# Altium schematic sheet MBD-SM.SchDoc
size A3; SheetNumber: 1; SheetTotal: 1
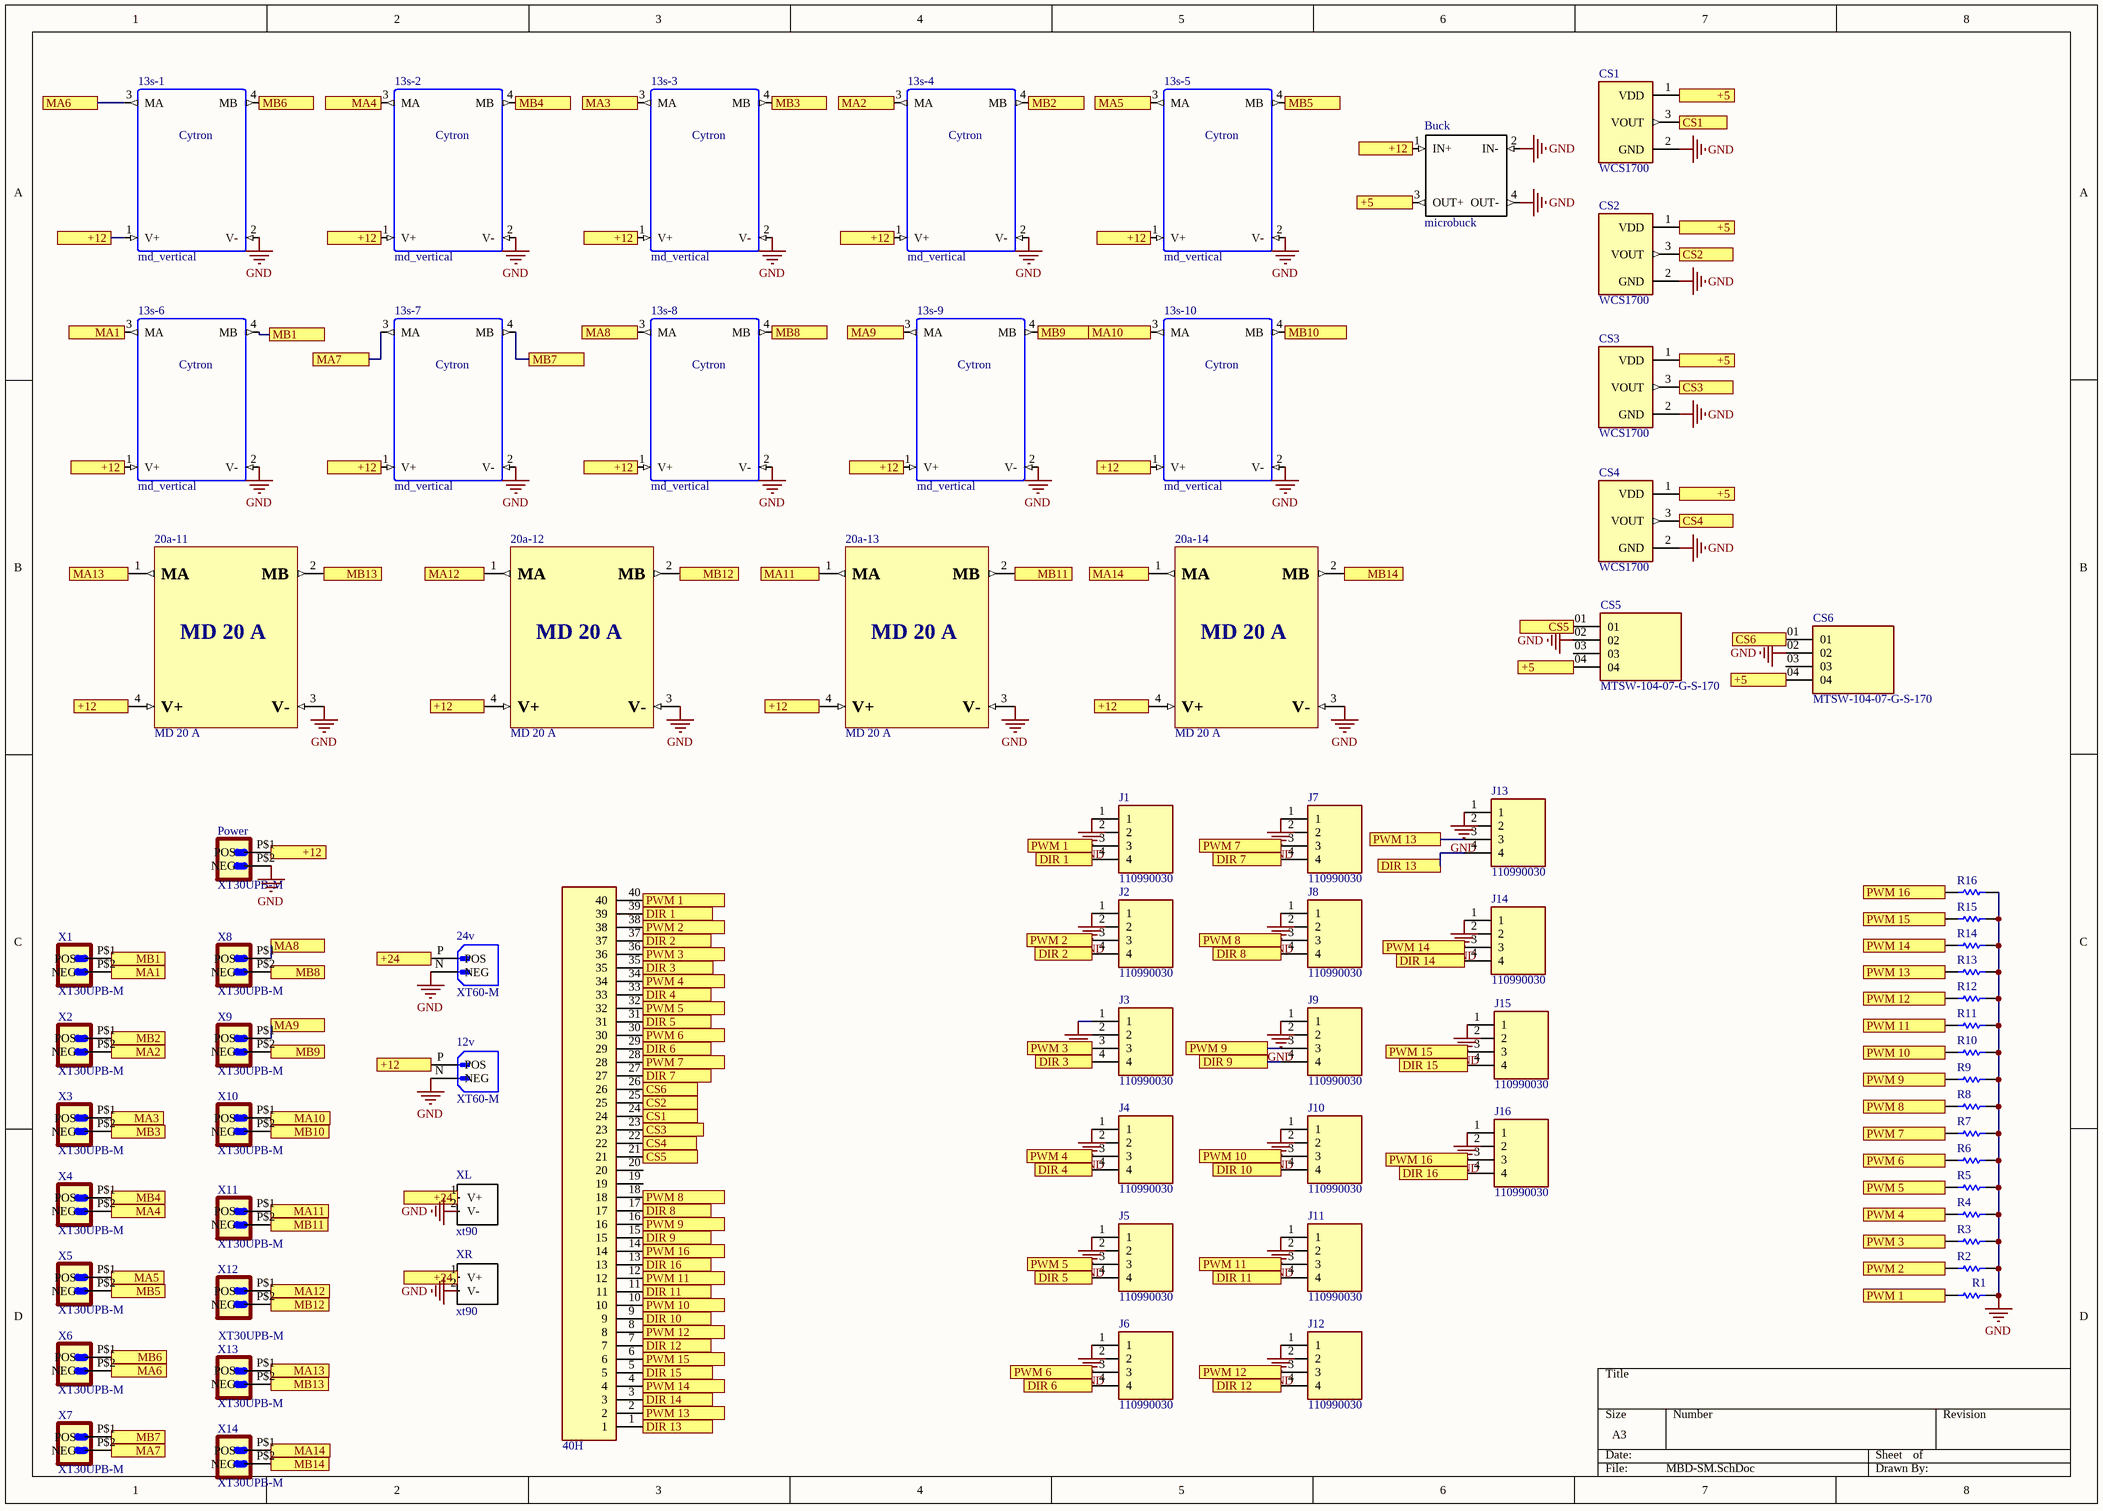
[diagram p0: MBD-SM.SchDoc]

## Parts
12v  XT60-M  [AMASS_XT60-M]
13s-1  md_vertical  [md_vertical]
13s-2  md_vertical  [md_vertical]
13s-3  md_vertical  [md_vertical]
13s-4  md_vertical  [md_vertical]
13s-5  md_vertical  [md_vertical]
13s-6  md_vertical  [md_vertical]
13s-7  md_vertical  [md_vertical]
13s-8  md_vertical  [md_vertical]
13s-9  md_vertical  [md_vertical]
13s-10  md_vertical  [md_vertical]
20a-11  MD 20 A  [MD20A]
20a-12  MD 20 A  [MD20A]
20a-13  MD 20 A  [MD20A]
20a-14  MD 20 A  [MD20A]
24v  XT60-M  [AMASS_XT60-M]
40H  3-1761603-3  [TE_3-1761603-3]  (value not drawn)
Buck  microbuck  [Micro buck]
CS1  WCS1700  [XDCR_WCS1700]
CS2  WCS1700  [XDCR_WCS1700]
CS3  WCS1700  [XDCR_WCS1700]
CS4  WCS1700  [XDCR_WCS1700]
CS5  MTSW-104-07-G-S-170  [SAMTEC_MTSW-104-07-G-S-170]
CS6  MTSW-104-07-G-S-170  [SAMTEC_MTSW-104-07-G-S-170]
J1  110990030  [SEEED_110990030]
J2  110990030  [SEEED_110990030]
J3  110990030  [SEEED_110990030]
J4  110990030  [SEEED_110990030]
J5  110990030  [SEEED_110990030]
J6  110990030  [SEEED_110990030]
J7  110990030  [SEEED_110990030]
J8  110990030  [SEEED_110990030]
J9  110990030  [SEEED_110990030]
J10  110990030  [SEEED_110990030]
J11  110990030  [SEEED_110990030]
J12  110990030  [SEEED_110990030]
J13  110990030  [SEEED_110990030]
J14  110990030  [SEEED_110990030]
J15  110990030  [SEEED_110990030]
J16  110990030  [SEEED_110990030]
Power  XT30UPB-M  [XT30UPB-M]
R1  CRCW060310K0FKEA  [RESC1609X50X30NL8T20]  (value not drawn)
R2  CRCW060310K0FKEA  [RESC1609X50X30NL8T20]  (value not drawn)
R3  CRCW060310K0FKEA  [RESC1609X50X30NL8T20]  (value not drawn)
R4  CRCW060310K0FKEA  [RESC1609X50X30NL8T20]  (value not drawn)
R5  CRCW060310K0FKEA  [RESC1609X50X30NL8T20]  (value not drawn)
R6  CRCW060310K0FKEA  [RESC1609X50X30NL8T20]  (value not drawn)
R7  CRCW060310K0FKEA  [RESC1609X50X30NL8T20]  (value not drawn)
R8  CRCW060310K0FKEA  [RESC1609X50X30NL8T20]  (value not drawn)
R9  CRCW060310K0FKEA  [RESC1609X50X30NL8T20]  (value not drawn)
R10  CRCW060310K0FKEA  [RESC1609X50X30NL8T20]  (value not drawn)
R11  CRCW060310K0FKEA  [RESC1609X50X30NL8T20]  (value not drawn)
R12  CRCW060310K0FKEA  [RESC1609X50X30NL8T20]  (value not drawn)
R13  CRCW060310K0FKEA  [RESC1609X50X30NL8T20]  (value not drawn)
R14  CRCW060310K0FKEA  [RESC1609X50X30NL8T20]  (value not drawn)
R15  CRCW060310K0FKEA  [RESC1609X50X30NL8T20]  (value not drawn)
R16  CRCW060310K0FKEA  [RESC1609X50X30NL8T20]  (value not drawn)
X1  XT30UPB-M  [XT30UPB-M]
X2  XT30UPB-M  [XT30UPB-M]
X3  XT30UPB-M  [XT30UPB-M]
X4  XT30UPB-M  [XT30UPB-M]
X5  XT30UPB-M  [XT30UPB-M]
X6  XT30UPB-M  [XT30UPB-M]
X7  XT30UPB-M  [XT30UPB-M]
X8  XT30UPB-M  [XT30UPB-M]
X9  XT30UPB-M  [XT30UPB-M]
X10  XT30UPB-M  [XT30UPB-M]
X11  XT30UPB-M  [XT30UPB-M]
X12  XT30UPB-M  [XT30UPB-M]
X13  XT30UPB-M  [XT30UPB-M]
X14  XT30UPB-M  [XT30UPB-M]
XL  xt90  [xt90]
XR  xt90  [xt90]

## Ports
+5, +12, +24, CS1, CS2, CS3, CS4, CS5, CS6, DIR 1, DIR 2, DIR 3, DIR 4, DIR 5, DIR 6, DIR 7, DIR 8, DIR 9, DIR 10, DIR 11, DIR 12, DIR 13, DIR 14, DIR 15, DIR 16, MA1, MA2, MA3, MA4, MA5, MA6, MA7, MA8, MA9, MA10, MA11, MA12, MA13, MA14, MB1, MB2, MB3, MB4, MB5, MB6, MB7, MB8, MB9, MB10, MB11, MB12, MB13, MB14, PWM 1, PWM 2, PWM 3, PWM 4, PWM 5, PWM 6, PWM 7, PWM 8, PWM 9, PWM 10, PWM 11, PWM 12, PWM 13, PWM 14, PWM 15, PWM 16

## Nets
GND: 12v.N(NEG) 13s-1.2(V-) 13s-2.2(V-) 13s-3.2(V-) 13s-4.2(V-) 13s-5.2(V-) 13s-6.2(V-) 13s-7.2(V-) 13s-8.2(V-) 13s-9.2(V-) 13s-10.2(V-) 20a-11.3(V-) 20a-12.3(V-) 20a-13.3(V-) 20a-14.3(V-) 24v.N(NEG) Buck.2(IN-) Buck.4(OUT-) CS1.2(GND) CS2.2(GND) CS3.2(GND) CS4.2(GND) CS5.02 CS6.02 J1.1 J2.1 J3.1 J4.1 J5.1 J6.1 J7.1 J8.1 J9.1 J10.1 J11.1 J12.1 J13.1 J14.1 J15.1 J16.1 Power.P$2(NEG) R1.2 R2.2 R3.2 R4.2 R5.2 R6.2 R7.2 R8.2 R9.2 R10.2 R11.2 R12.2 R13.2 R14.2 R15.2 R16.2 XL.2(V-) XR.2(V-)
+5: Buck.3(OUT+) CS1.1(VDD) CS2.1(VDD) CS3.1(VDD) CS4.1(VDD) CS5.04 CS6.04 ; port +5
+12: 12v.P(POS) 13s-1.1(V+) 13s-2.1(V+) 13s-3.1(V+) 13s-4.1(V+) 13s-5.1(V+) 13s-6.1(V+) 13s-7.1(V+) 13s-8.1(V+) 13s-9.1(V+) 13s-10.1(V+) 20a-11.4(V+) 20a-12.4(V+) 20a-13.4(V+) 20a-14.4(V+) Buck.1(IN+) Power.P$1(POS) ; port +12
+24: 24v.P(POS) XL.1(V+) XR.1(V+) ; port +24
CS1: 40H.24 CS1.3(VOUT) ; port CS1
CS2: 40H.25 CS2.3(VOUT) ; port CS2
CS3: 40H.23 CS3.3(VOUT) ; port CS3
CS4: 40H.22 CS4.3(VOUT) ; port CS4
CS5: 40H.21 CS5.01 ; port CS5
CS6: 40H.26 CS6.01 ; port CS6
DIR 1: 40H.39 J1.4 ; port DIR 1
DIR 2: 40H.37 J2.4 ; port DIR 2
DIR 3: 40H.35 J3.4 ; port DIR 3
DIR 4: 40H.33 J4.4 ; port DIR 4
DIR 5: 40H.31 J5.4 ; port DIR 5
DIR 6: 40H.29 J6.4 ; port DIR 6
DIR 7: 40H.27 J7.4 ; port DIR 7
DIR 8: 40H.17 J8.4 ; port DIR 8
DIR 9: 40H.15 J9.4 ; port DIR 9
DIR 10: 40H.9 J10.4 ; port DIR 10
DIR 11: 40H.11 J11.4 ; port DIR 11
DIR 12: 40H.7 J12.4 ; port DIR 12
DIR 13: 40H.1 J13.4 ; port DIR 13
DIR 14: 40H.3 J14.4 ; port DIR 14
DIR 15: 40H.5 J15.4 ; port DIR 15
DIR 16: 40H.13 J16.4 ; port DIR 16
MA1: 13s-6.3(MA) X1.P$2(NEG) ; port MA1
MA2: 13s-4.3(MA) X2.P$2(NEG) ; port MA2
MA3: 13s-3.3(MA) X3.P$1(POS) ; port MA3
MA4: 13s-2.3(MA) X4.P$2(NEG) ; port MA4
MA5: 13s-5.3(MA) X5.P$1(POS) ; port MA5
MA6: 13s-1.3(MA) X6.P$2(NEG) ; port MA6
MA7: 13s-7.3(MA) X7.P$2(NEG) ; port MA7
MA8: 13s-8.3(MA) X8.P$1(POS) ; port MA8
MA9: 13s-9.3(MA) X9.P$1(POS) ; port MA9
MA10: 13s-10.3(MA) X10.P$1(POS) ; port MA10
MA11: 20a-13.1(MA) X11.P$1(POS) ; port MA11
MA12: 20a-12.1(MA) X12.P$1(POS) ; port MA12
MA13: 20a-11.1(MA) X13.P$1(POS) ; port MA13
MA14: 20a-14.1(MA) X14.P$1(POS) ; port MA14
MB1: 13s-6.4(MB) X1.P$1(POS) ; port MB1
MB2: 13s-4.4(MB) X2.P$1(POS) ; port MB2
MB3: 13s-3.4(MB) X3.P$2(NEG) ; port MB3
MB4: 13s-2.4(MB) X4.P$1(POS) ; port MB4
MB5: 13s-5.4(MB) X5.P$2(NEG) ; port MB5
MB6: 13s-1.4(MB) X6.P$1(POS) ; port MB6
MB7: 13s-7.4(MB) X7.P$1(POS) ; port MB7
MB8: 13s-8.4(MB) X8.P$2(NEG) ; port MB8
MB9: 13s-9.4(MB) X9.P$2(NEG) ; port MB9
MB10: 13s-10.4(MB) X10.P$2(NEG) ; port MB10
MB11: 20a-13.2(MB) X11.P$2(NEG) ; port MB11
MB12: 20a-12.2(MB) X12.P$2(NEG) ; port MB12
MB13: 20a-11.2(MB) X13.P$2(NEG) ; port MB13
MB14: 20a-14.2(MB) X14.P$2(NEG) ; port MB14
PWM 1: 40H.40 J1.3 R1.1 ; port PWM 1
PWM 2: 40H.38 J2.3 R2.1 ; port PWM 2
PWM 3: 40H.36 J3.3 R3.1 ; port PWM 3
PWM 4: 40H.34 J4.3 R4.1 ; port PWM 4
PWM 5: 40H.32 J5.3 R5.1 ; port PWM 5
PWM 6: 40H.30 J6.3 R6.1 ; port PWM 6
PWM 7: 40H.28 J7.3 R7.1 ; port PWM 7
PWM 8: 40H.18 J8.3 R8.1 ; port PWM 8
PWM 9: 40H.16 J9.3 R9.1 ; port PWM 9
PWM 10: 40H.10 J10.3 R10.1 ; port PWM 10
PWM 11: 40H.12 J11.3 R11.1 ; port PWM 11
PWM 12: 40H.8 J12.3 R12.1 ; port PWM 12
PWM 13: 40H.2 J13.3 R13.1 ; port PWM 13
PWM 14: 40H.4 J14.3 R14.1 ; port PWM 14
PWM 15: 40H.6 J15.3 R15.1 ; port PWM 15
PWM 16: 40H.14 J16.3 R16.1 ; port PWM 16

Not connected (* = marked no-connect by the designer): 40H 19 20; CS5 03; CS6 03; J1 2; J2 2; J3 2; J4 2; J5 2; J6 2; J7 2; J8 2; J9 2; J10 2; J11 2; J12 2; J13 2; J14 2; J15 2; J16 2

## Notes on the sheet
- (in symbol md_vertical) Cytron

## Library data of the parts
12v 24v = XT60-M: Plug; DC supply; XT60; male; PIN: 2; for cable; soldered; 30A; 500V; MF: AMASS; SnapEDA_Link: https://www.snapeda.com/parts/XT60-M/AMASS/view-part/?ref=snap; Package: Package; Value: *; MP: XT60-M; Check_prices: https://www.snapeda.com/parts/XT60-M/AMASS/view-part/?ref=eda
20a-11-20a-14 = MD20A
40H = 3-1761603-3: AMP-LATCH 40 Position 2.54 mm Dual Row Through-Hole Straight Pin Header; Centerline_Pitch: 2.54 mm[.1 in]; Number_of_Positions: 40; MF: TE Connectivity; Product_Type: Connector; MP: 3-1761603-3; SnapEDA_Link: https://www.snapeda.com/parts/3-1761603-3/TE%20Connectivity%20AMP%20Connectors/view-part/379325/?ref=snap; Value: *; Package: None; DigiKey-Purchase-URL: https://snapeda.com/shop?store=DigiKey&id=379325; Price: None; EU_RoHS_Compliance: Compliant; Availability: Unavailable
CS1-CS4 = WCS1700: The Winson WCS1700 current sensor provides economical and precisesolution for both DC and AC current sensing in industrial, commercial andcommunications systems.; SnapEDA_Link: https://www.snapeda.com/parts/WCS1700/Winson/view-part/?ref=snap; Package: Package; Value: *; MF: Winson; MP: WCS1700; Check_prices: https://www.snapeda.com/parts/WCS1700/Winson/view-part/?ref=eda
J1-J16 = 110990030: GROVE 2MM 4PIN VERT CONN 10PCS; MF: Seeed Technology; Arrow_Electronics-Purchase-URL: https://snapeda.com/shop?store=Arrow+Electronics&id=583576; Availability: Good; Package: None; Price: None; Mouser-Purchase-URL: https://snapeda.com/shop?store=Mouser&id=583576; MP: 110990030; SnapEDA_Link: https://www.snapeda.com/parts/110990030/Seeed%20Technology%20Co.,%20Ltd/view-part/583576/?ref=snap; Value: *
Power X1-X14 = XT30UPB-M: Socket; DC supply; XT30; male; PIN: 2; on PCBs; THT; yellow; 15A; 500V; MF: amass; MP: XT30UPB-M; Value: *; SnapEDA_Link: https://www.snapeda.com/parts/XT30UPB-M/AMASS/view-part/?ref=snap; Price: None; Package: None; Check_prices: https://www.snapeda.com/parts/XT30UPB-M/AMASS/view-part/?ref=eda; Availability: Not in stock
R1-R16 = CMP-1666-00005-4: Chip Resistor, 10 KOhm, +/- 1%, 100 mW, -55 to 155 degC, 0603 (1608 Metric), RoHS, Tape and Reel; Manufacturer: Vishay Semiconductor; Voltage Rating: 75 V; Max Operating Temperature: 155 degC; PackageDescription: 2-Pin Surface Mount Device, Body 1.575 x 0.85 mm; ComponentLink1Description: Manufacturer URL; RoHSCompliant: true; PackageReference: 0603; REACH SVHC: Unknown; Length: 1.55 mm; DatasheetVersion: 06/2012; Packaging: Tape and Reel; Min Operating Temperature: -55 degC; Mounting Technology: Surface Mount; ComponentLink2URL: https://datasheet.ciiva.com/11809/0900766b80d98afc-11809037.pdf; Height: 0.45 mm; ComponentLink2Description: Datasheet; Package Quantity: 5000; ComponentLink1URL: http://www.vishay.com/
CS5 CS6 = MTSW-104-07-G-S-170: Availability: Unavailable; Value: *; Package: None; MP: MTSW-104-07-G-S-170; Price: None